# Altium schematic sheet PLBank34.SchDoc
size A4; SheetNumber: 11; SheetTotal: 18
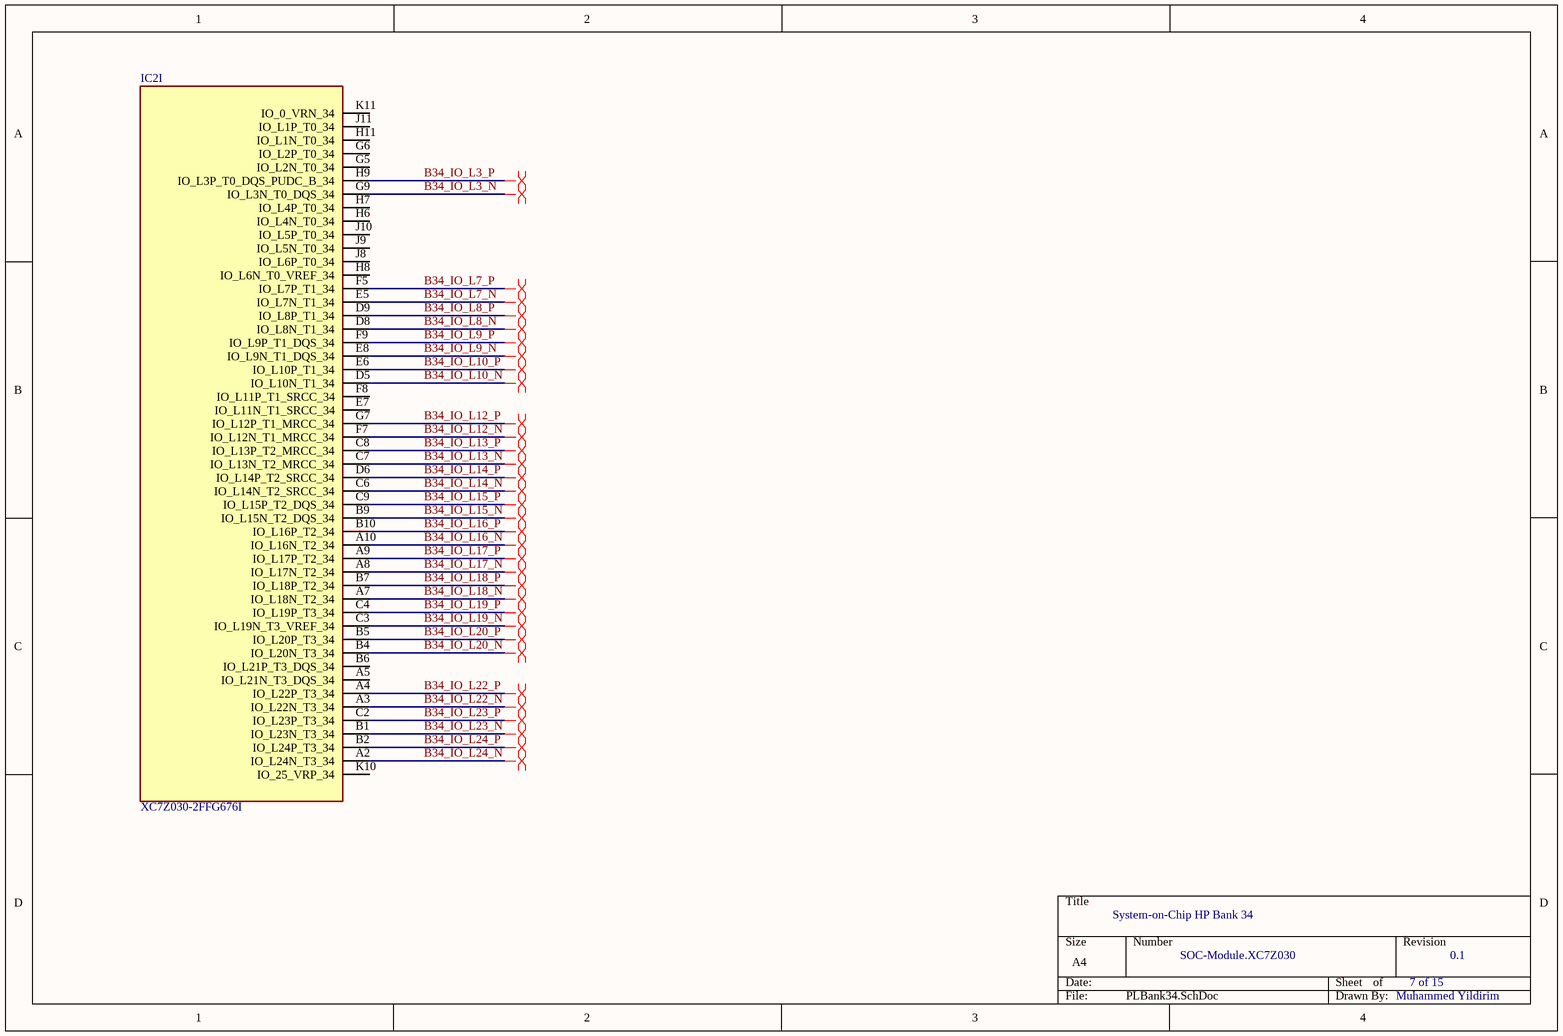
[diagram p0: PLBank34.SchDoc]

## Parts
IC2  XC7Z030-2FFG676I  [BGA676C100P26X26_2700X2700X324]  (part I of 15)

## Nets
B34_IO_L3_N: IC2.G9(IO_L3N_T0_DQS_34)
B34_IO_L3_P: IC2.H9(IO_L3P_T0_DQS_PUDC_B_34)
B34_IO_L7_N: IC2.E5(IO_L7N_T1_34)
B34_IO_L7_P: IC2.F5(IO_L7P_T1_34)
B34_IO_L8_N: IC2.D8(IO_L8N_T1_34)
B34_IO_L8_P: IC2.D9(IO_L8P_T1_34)
B34_IO_L9_N: IC2.E8(IO_L9N_T1_DQS_34)
B34_IO_L9_P: IC2.F9(IO_L9P_T1_DQS_34)
B34_IO_L10_N: IC2.D5(IO_L10N_T1_34)
B34_IO_L10_P: IC2.E6(IO_L10P_T1_34)
B34_IO_L12_N: IC2.F7(IO_L12N_T1_MRCC_34)
B34_IO_L12_P: IC2.G7(IO_L12P_T1_MRCC_34)
B34_IO_L13_N: IC2.C7(IO_L13N_T2_MRCC_34)
B34_IO_L13_P: IC2.C8(IO_L13P_T2_MRCC_34)
B34_IO_L14_N: IC2.C6(IO_L14N_T2_SRCC_34)
B34_IO_L14_P: IC2.D6(IO_L14P_T2_SRCC_34)
B34_IO_L15_N: IC2.B9(IO_L15N_T2_DQS_34)
B34_IO_L15_P: IC2.C9(IO_L15P_T2_DQS_34)
B34_IO_L16_N: IC2.A10(IO_L16N_T2_34)
B34_IO_L16_P: IC2.B10(IO_L16P_T2_34)
B34_IO_L17_N: IC2.A8(IO_L17N_T2_34)
B34_IO_L17_P: IC2.A9(IO_L17P_T2_34)
B34_IO_L18_N: IC2.A7(IO_L18N_T2_34)
B34_IO_L18_P: IC2.B7(IO_L18P_T2_34)
B34_IO_L19_N: IC2.C3(IO_L19N_T3_VREF_34)
B34_IO_L19_P: IC2.C4(IO_L19P_T3_34)
B34_IO_L20_N: IC2.B4(IO_L20N_T3_34)
B34_IO_L20_P: IC2.B5(IO_L20P_T3_34)
B34_IO_L22_N: IC2.A3(IO_L22N_T3_34)
B34_IO_L22_P: IC2.A4(IO_L22P_T3_34)
B34_IO_L23_N: IC2.B1(IO_L23N_T3_34)
B34_IO_L23_P: IC2.C2(IO_L23P_T3_34)
B34_IO_L24_N: IC2.A2(IO_L24N_T3_34)
B34_IO_L24_P: IC2.B2(IO_L24P_T3_34)

Not connected (* = marked no-connect by the designer): IC2 A5(IO_L21N_T3_DQS_34) B6(IO_L21P_T3_DQS_34) E7(IO_L11N_T1_SRCC_34) F8(IO_L11P_T1_SRCC_34) G5(IO_L2N_T0_34) G6(IO_L2P_T0_34) H6(IO_L4N_T0_34) H7(IO_L4P_T0_34) H8(IO_L6N_T0_VREF_34) H11(IO_L1N_T0_34) J8(IO_L6P_T0_34) J9(IO_L5N_T0_34) J10(IO_L5P_T0_34) J11(IO_L1P_T0_34) K10(IO_25_VRP_34) K11(IO_0_VRN_34)

## Layout directives
differential pair: B34_IO_L3_N, B34_IO_L3_P, B34_IO_L7_N, B34_IO_L7_P, B34_IO_L8_N, B34_IO_L8_P, B34_IO_L9_N, B34_IO_L9_P, B34_IO_L10_N, B34_IO_L10_P, B34_IO_L12_N, B34_IO_L12_P, B34_IO_L13_N, B34_IO_L13_P, B34_IO_L14_N, B34_IO_L14_P, B34_IO_L15_N, B34_IO_L15_P, B34_IO_L16_N, B34_IO_L16_P, B34_IO_L17_N, B34_IO_L17_P, B34_IO_L18_N, B34_IO_L18_P, B34_IO_L19_N, B34_IO_L19_P, B34_IO_L20_N, B34_IO_L20_P, B34_IO_L22_N, B34_IO_L22_P, B34_IO_L23_N, B34_IO_L23_P, B34_IO_L24_N, B34_IO_L24_P

## Notes on the sheet
- System-on-Chip HP Bank 34
- SOC-Module.XC7Z030
- 7 of 15
- 0.1
- Muhammed Yildirim

## Library data of the parts
IC2 = XC7Z030-2FFG676I: Integrated Circuit; Manufacturer_Name: AMD; Datasheet Link: http://www.xilinx.com/support/documentation/data_sheets/ds190-Zynq-7000-Overview.pdf; Height: 3.24mm; Manufacturer_Part_Number: XC7Z030-2FFG676I; Mouser Part Number: 217-XC7Z030-2FFG676I; Mouser Price/Stock: https://www.mouser.co.uk/ProductDetail/Xilinx/XC7Z030-2FFG676I?qs=rrS6PyfT74cuZK5O3CSpmw%3D%3D